# Altium schematic sheet Buck.SchDoc: Buck.SchDoc
size A4; Organization: Altium Limited; Address1: L3, 12a Rodborough Rd; Address2: Frenchs Forest; Address3: NSW; Address4: Australia 2086
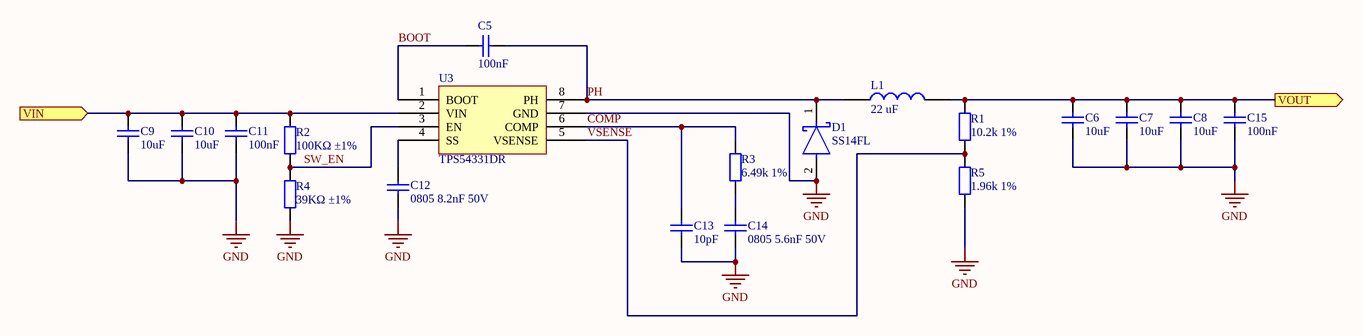
[diagram p0: Buck.SchDoc]

## Parts
C5  100nF  [0603_C]
C6  10uF  [0603_C]
C7  10uF  [0603_C]
C8  10uF  [0603_C]
C9  10uF  [0805_C]
C10  10uF  [0805_C]
C11  100nF  [0603_C]
C12  0805 8.2nF 50V  [0805_C]
C13  10pF  [0603_C]
C14  0805 5.6nF 50V  [0805_C]
C15  100nF  [0603_C]
D1  SS14FL  [FP-425AD-MFG]
L1  22 uF  [COBU-DR74-4R7-R_V]
R1  10.2k 1%  [1206_R]
R2  100KΩ ±1%  [0805_R]
R3  6.49k 1%  [0805_R]
R4  39KΩ ±1%  [0805_R]
R5  1.96k 1%  [1206_R]
U3  TPS54331DR  [SOIC-8_150mil]

## Ports
VIN (in), VOUT (out)

## Nets
GND: C6.1 C7.1 C8.1 C9.1 C10.1 C11.1 C12.1 C13.1 C14.1 C15.1 D1.2(A) R4.1 R5.1 U3.7(GND)
BOOT: C5.2 U3.1(BOOT)
COMP: C13.2 R3.2 U3.6(COMP)
PH: C5.1 D1.1(C) L1.1 U3.8(PH)
SW_EN: R2.2 R4.2 U3.3(EN)
VIN: C9.2 C10.2 C11.2 R2.1 U3.2(VIN) ; port VIN
VOUT: C6.2 C7.2 C8.2 C15.2 L1.2 R1.1 ; port VOUT
VSENSE: R1.2 R5.2 U3.5(VSENSE)
NetC12_2: C12.2 U3.4(SS)
NetC14_2: C14.2 R3.1

## Notes on the sheet
- Title
- Size:
- Date:
- A4
- Number:
- Time:
- Revision:
- Sheet
- of
- File:

## Library data of the parts
C5 C11 C15 = 0603 100nF (104) 10% 50V: Chip capacitors; Manufacturer: YAGEO; PartNumber: CC0603KRX7R9BB104; Tolerance: 10%; Voltage: 50V; ComponentLink1Description: Supplier link; ComponentLink1URL: http://www.szlcsc.com/product/details_15331.html; Package: 0603; Supplier: LC; SuppliersPartNumber: C14663; Capacitance: 100nF
C6-C8 = 0603 10uF (106) 10% 10V: Chip capacitors; Manufacturer: Samsung Electro-Mechanics; PartNumber: CL10A106KP8NNNC; Tolerance: 10%; Voltage: 10V; ComponentLink1Description: Supplier link; ComponentLink1URL: http://www.szlcsc.com/product/details_20411.html; Package: 0603; Supplier: LC; SuppliersPartNumber: C19702; Capacitance: 10uF
C9 C10 = 0805 10uF (106) 10% 25V: Chip capacitors; Manufacturer: Samsung Electro-Mechanics; PartNumber: CL21A106KAYNNNE; Tolerance: 10%; Voltage: 25V; ComponentLink1Description: Supplier link; ComponentLink1URL: http://www.szlcsc.com/product/details_16532.html; Package: 0805; Supplier: LC; SuppliersPartNumber: C15850; Capacitance: 10uF
C12 = 0805 8.2nF 50V: PartNumber: CL21B822KBANNNC; LCSC: C170117
C13 = 0603 10pF (100) 5% 50V: Chip capacitors; Manufacturer: Samsung Electro-Mechanics; PartNumber: CL10C100JB8NNNC; Tolerance: 5%; Voltage: 50V; ComponentLink1Description: Supplier link; ComponentLink1URL: http://www.szlcsc.com/product/details_1986.html; Package: 0603; Supplier: LC; SuppliersPartNumber: C1634; Capacitance: 10pF
C14 = 0805 5.6nF 50V: PartNumber: CL21B562KBANNNC; LCSC: C153719
D1 = CMP-07162-000013-1: DIODE SCHOTTKY 40V 1A SOD123F; Manufacturer: ON Semiconductor; Max Junction Temp: +125°C; Value: 60pF; Max Surge Forward Current: 40A; Peak Reverse Current: 30uA; Device Class L3: Schottky Diodes; Reverse Voltage: 40V; Automotive: No; Temperature: -55°C to +125°C; Mouser Description: SS14FL Series 40 V 1 A Surface Mount Schottky Barrier Rectifier - SOD-123F; Octopart: https://octopart.com/ss14fl-on+semiconductor-84331601; Height: 1.08mm; Temperature Range Low: -55°C; Category: Diode; Lead Free: Yes; Device Class L1: Discrete Semiconductors; Digikey Description: DIODE SCHOTTKY 40V 1A SOD123F; RoHS: TRUE; ComponentLink2Description: Datasheet; Manufacturer Part Number: SS14FL; Forward Current: 1A; Capacitance: 60pF; Package: 425AD; Device Class L2: Diodes; Temperature Range High: +125°C; Max Repetitive Reverse Voltage: 40V; ComponentLink2URL: https://www.onsemi.com/pub/Collateral/SS14FL-D.PDF
L1 = SRP6540-5R6M
R1 = 1206 10.2k 1%: PartNumber: 1206W4F1022T5E; LCSC: C247410
R2 = 0805 100K (1003) 1%: Chip resistor; Manufacturer: Uniroyal Elec; Power: 1/8W; ComponentLink1Description: Supplier link; ComponentLink1URL: http://www.szlcsc.com/product/details_18095.html; Package: 0805; Supplier: LC; SuppliersPartNumber: C17407; Tolerance: 1%
R3 = 0805 6.49k 1%: PartNumber: 0805W8F6491T5E; LCSC: C17769
R4 = 0805 39K (3902) 1%: Chip resistor; Manufacturer: Uniroyal Elec; Power: 1/8W; ComponentLink1Description: Supplier link; ComponentLink1URL: http://www.szlcsc.com/product/details_26569.html; Package: 0805; Supplier: LC; SuppliersPartNumber: C25826; Tolerance: 1%
R5 = 1206 1.96k 1%: PartNumber: 1206W4F1022T5E; LCSC: C247410
U3 = TPS54331DR_[C9865]: DC-DC芯片; ComponentLink1Description: 供应商链接; ComponentLink1URL: http://www.szlcsc.com/product/details_10397.html; Package: SOIC-8_150mil; Supplier: LC; SuppliersPartNumber: C9865